# EAGLE schematic TIA (EAGLE 6.5.0)
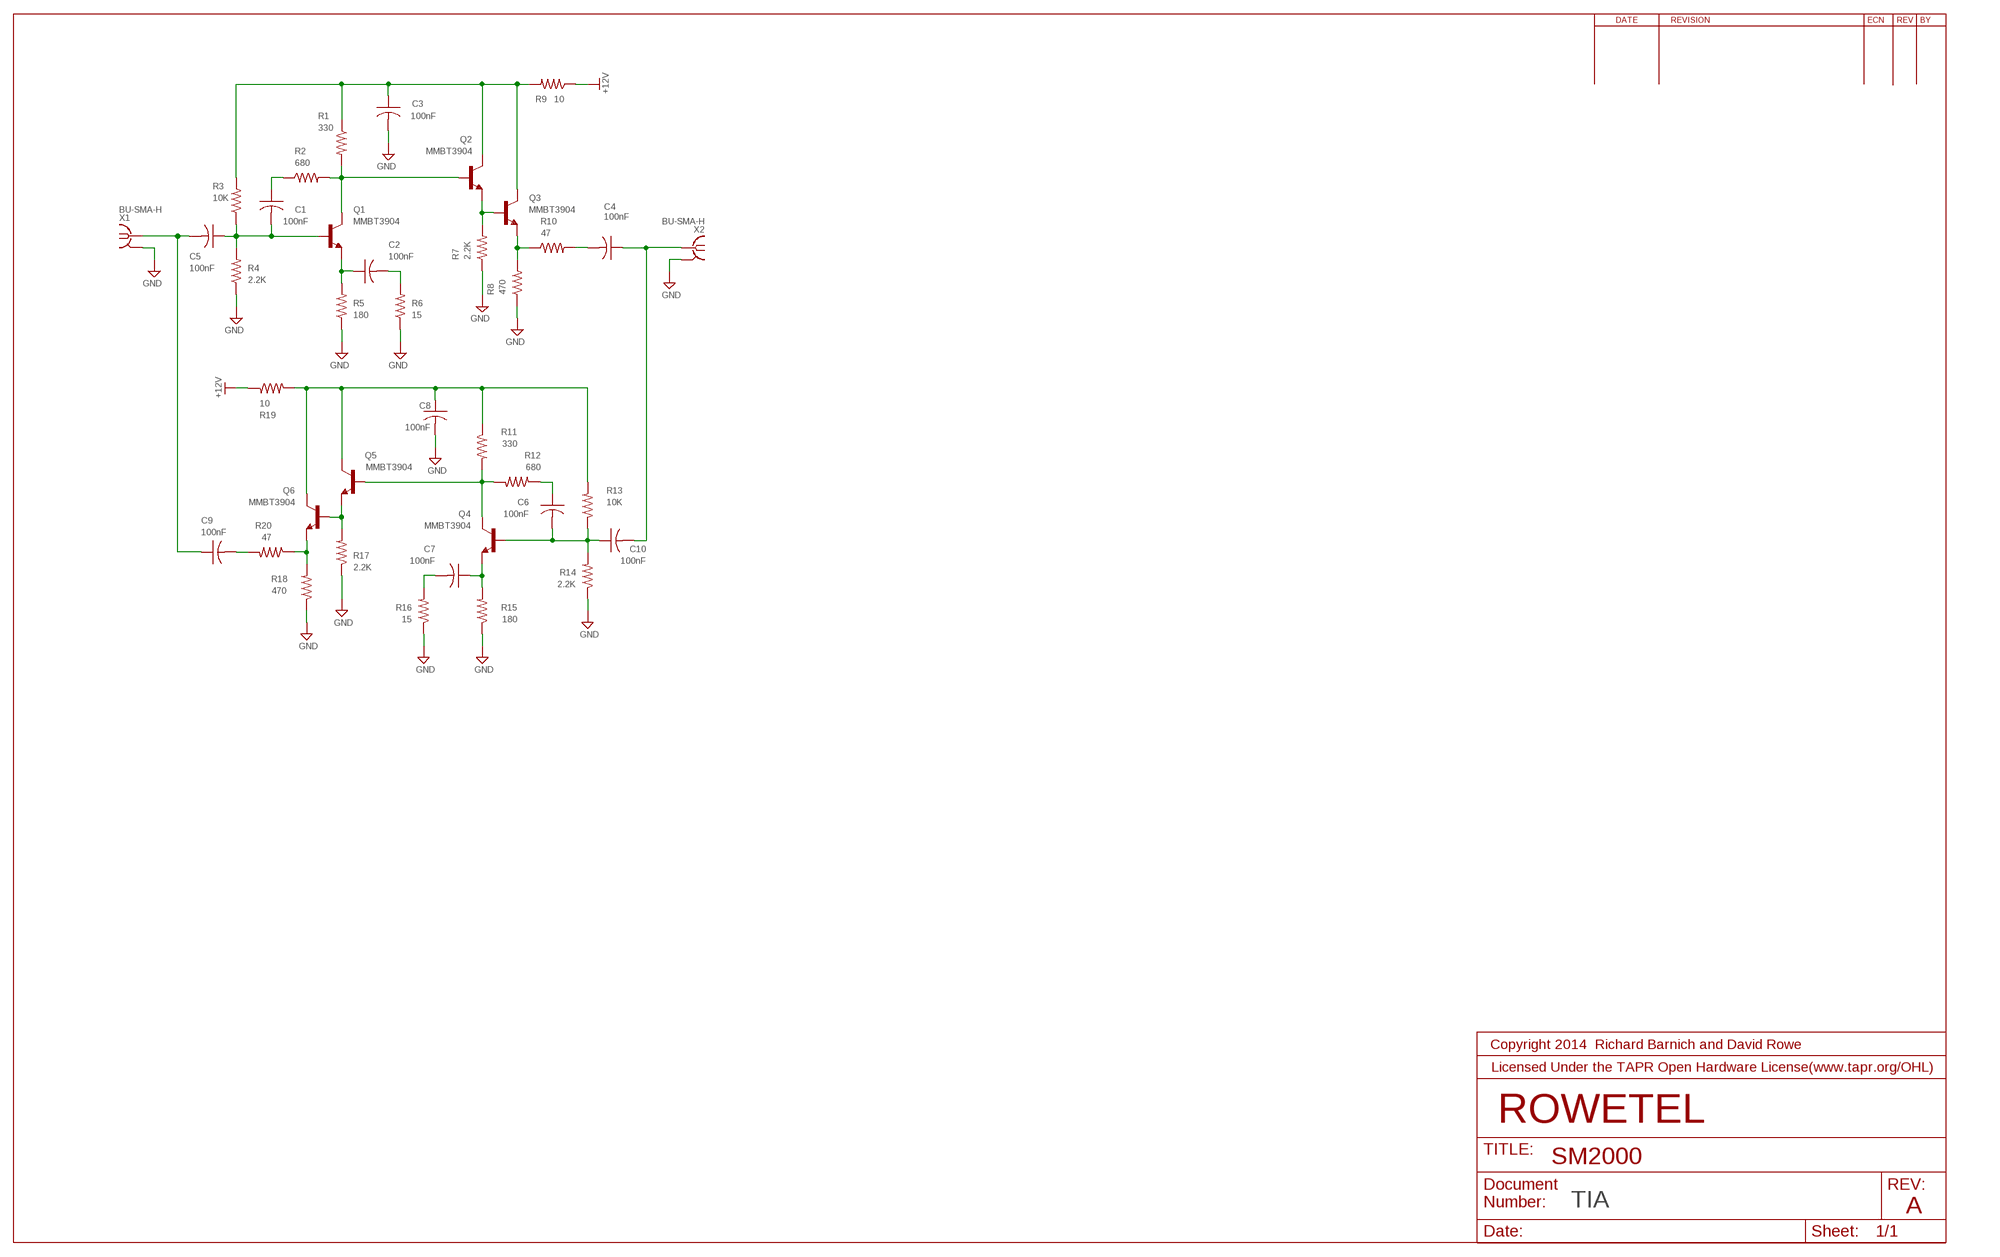
[diagram p0: schematic, sheet 1]

## Parts
C1  100nF  CAP-0805  [C0805]
C2  100nF  CAP-0805  [C0805]
C3  100nF  CAP-0805  [C0805]
C4  100nF  CAP-0805  [C0805]
C5  100nF  CAP-0805  [C0805]
C6  100nF  CAP-0805  [C0805]
C7  100nF  CAP-0805  [C0805]
C8  100nF  CAP-0805  [C0805]
C9  100nF  CAP-0805  [C0805]
C10  100nF  CAP-0805  [C0805]
Q1  MMBT3904  [SOT23]
Q2  MMBT3904  [SOT23]
Q3  MMBT3904  [SOT23]
Q4  MMBT3904  [SOT23]
Q5  MMBT3904  [SOT23]
Q6  MMBT3904  [SOT23]
R1  330  RES0805  [RR0805]
R2  680  RES0805  [RR0805]
R3  10K  RES0805  [RR0805]
R4  2.2K  RES0805  [RR0805]
R5  180  RES0805  [RR0805]
R6  15  RES0805  [RR0805]
R7  2.2K  RES0805  [RR0805]
R8  470  RES0805  [RR0805]
R9  10  RES0805  [RR0805]
R10  47  RES0805  [RR0805]
R11  330  RES0805  [RR0805]
R12  680  RES0805  [RR0805]
R13  10K  RES0805  [RR0805]
R14  2.2K  RES0805  [RR0805]
R15  180  RES0805  [RR0805]
R16  15  RES0805  [RR0805]
R17  2.2K  RES0805  [RR0805]
R18  470  RES0805  [RR0805]
R19  10  RES0805  [RR0805]
R20  47  RES0805  [RR0805]
X1  BU-SMA-H  [BU-SMA-H]
X2  BU-SMA-H  [BU-SMA-H]

## Nets
+12V: R9.1 R19.1
GND: C3.2 C8.2 R4.1 R5.1 R6.1 R7.1 R8.1 R14.1 R15.1 R16.1 R17.1 R18.1 X1.2 X1.3 X1.4 X1.5 X2.2 X2.3 X2.4 X2.5
N$1: Q1.3(C) Q2.1(B) R1.2 R2.2
N$2: C3.1 Q2.3(C) Q3.3(C) R1.1 R3.2 R9.2
N$3: Q2.2(E) Q3.1(B) R7.2
N$4: C1.1 R2.1
N$5: C1.2 C5.1 Q1.1(B) R3.1 R4.2
N$6: C2.1 Q1.2(E) R5.2
N$7: C2.2 R6.2
N$14: Q3.2(E) R8.2 R10.1
N$15: C4.2 R10.2
N$16: C4.1 C10.2 X2.1
N$18: Q4.3(C) Q5.1(B) R11.2 R12.2
N$19: C8.1 Q5.3(C) Q6.3(C) R11.1 R13.2 R19.2
N$20: Q5.2(E) Q6.1(B) R17.2
N$21: C6.1 R12.1
N$22: C6.2 C10.1 Q4.1(B) R13.1 R14.2
N$23: C7.1 Q4.2(E) R15.2
N$24: C7.2 R16.2
N$25: Q6.2(E) R18.2 R20.1
N$26: C9.2 R20.2
N$27: C5.2 C9.1 X1.1

## Notes on the sheet
- SM2000
- A

## Library data of the parts
C1-C10 = _RoweTel:CAP-0805
Q1-Q6 = _RoweTel:MMBT3904
R1-R20 = _RoweTel:RES0805
X1 X2 = _RoweTel:BU-SMA-H: FEMALE SMA CONNECTOR Radiall; OC_FARNELL: unknown; OC_NEWARK: unknown